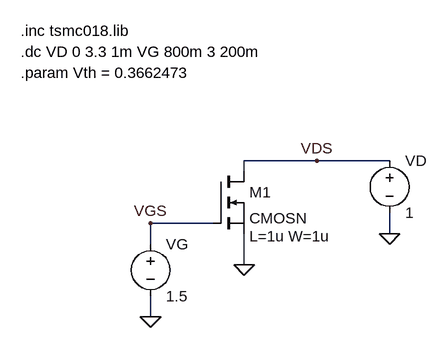
[diagram p0: schematic q2_a.asc]
q2_a.asc, the LTspice schematic file:
Version 4.1
SHEET 1 880 680
WIRE 336 176 224 176
WIRE 448 176 336 176
WIRE 224 192 224 176
WIRE 176 272 80 272
WIRE 448 288 448 256
WIRE 80 304 80 272
WIRE 224 336 224 288
WIRE 80 416 80 384
FLAG 224 336 0
FLAG 80 272 VGS
FLAG 336 176 VDS
FLAG 80 416 0
FLAG 448 288 0
SYMBOL nmos 176 192 R0
WINDOW 123 56 100 Left 2
SYMATTR Value2 L=1u W=1u
SYMATTR InstName M1
SYMATTR Value CMOSN
SYMBOL voltage 80 288 R0
WINDOW 123 0 0 Left 0
WINDOW 39 0 0 Left 0
SYMATTR InstName VG
SYMATTR Value 1.5
SYMBOL voltage 448 160 R0
WINDOW 123 0 0 Left 0
WINDOW 39 0 0 Left 0
SYMATTR InstName VD
SYMATTR Value 1
TEXT -120 -24 Left 2 !.inc tsmc018.lib
TEXT -120 8 Left 2 !.dc VD 0 3.3 1m VG 800m 3 200m
TEXT -120 40 Left 2 !.param Vth = 0.3662473

The netlist it stands for:
* q2_a.asc
M1 VDS VGS 0 0 CMOSN L=1u W=1u
VG VGS 0 1.5
VD VDS 0 1
.model NMOS NMOS
.model PMOS PMOS
.lib standard.mos
.inc tsmc018.lib
.dc VD 0 3.3 1m VG 800m 3 200m
.param Vth = 0.3662473
.backanno
.end